# EAGLE design extruder-controller4 (EAGLE 5.04)
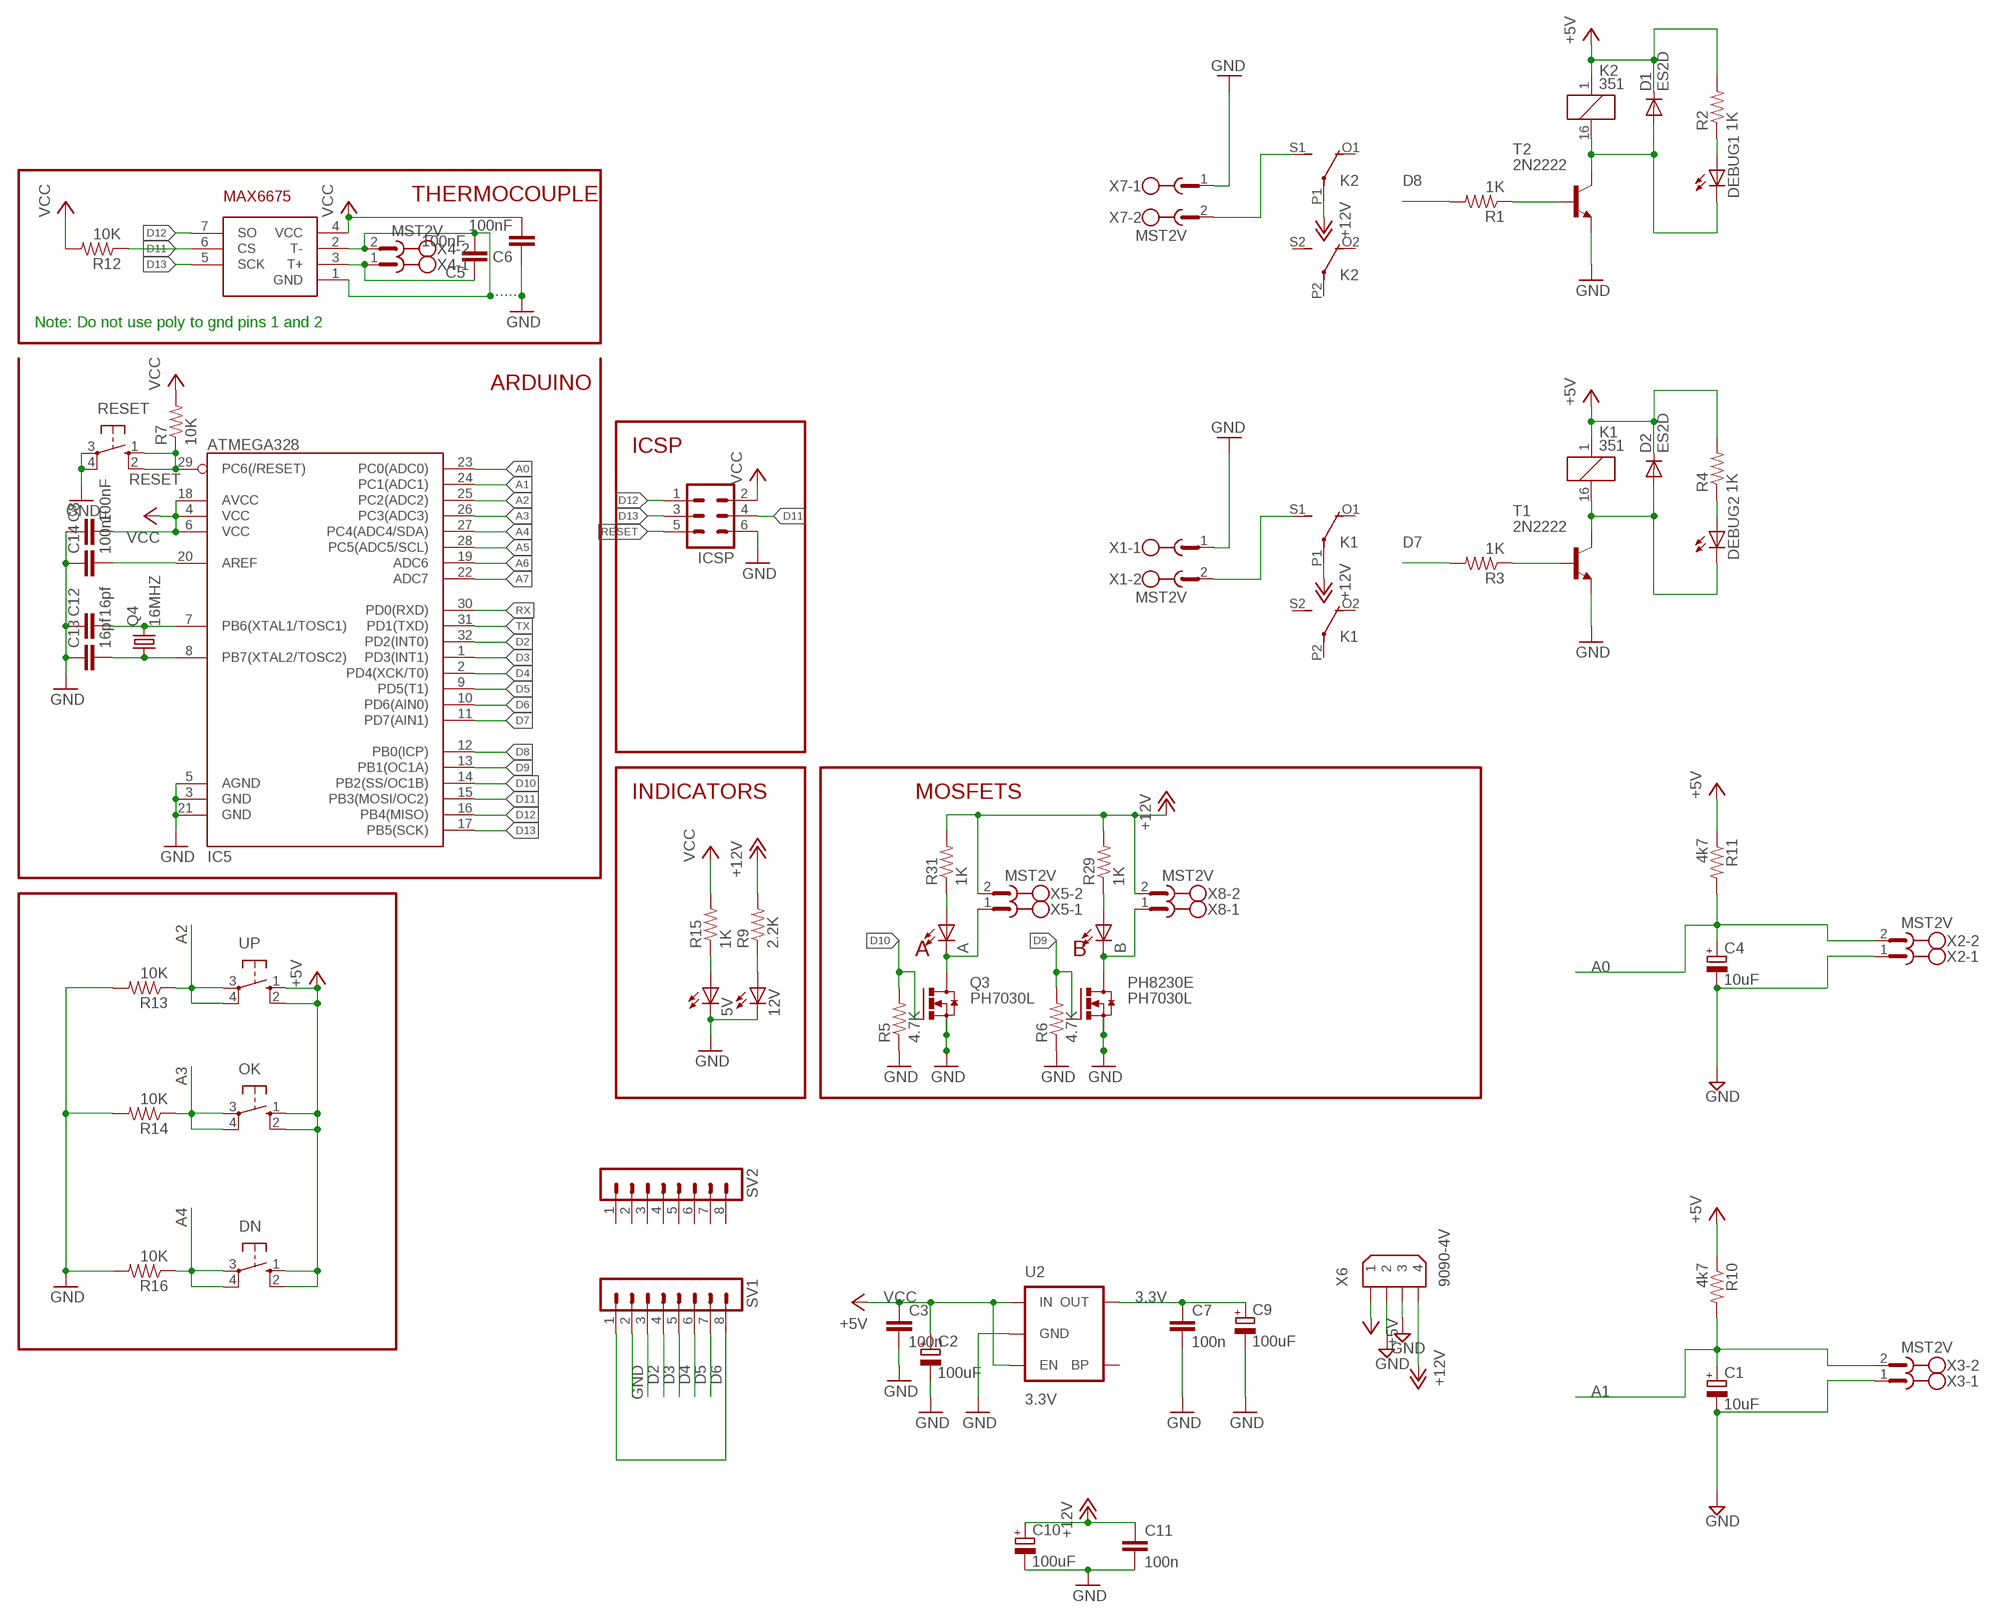
[diagram p0: schematic, sheet 1]

## Parts
5V  LED0805  [LED-0805]
12V  LED0805  [LED-0805]
A  LED0805  [LED-0805]
B  LED0805  [LED-0805]
C1  10uF  CPOL-EUE5-6  [E5-6]
C2  100uF  CPOL-EUE5-6  [E5-6]
C3  100n  CAP0805  [0805]
C4  10uF  CPOL-EUE5-6  [E5-6]
C5  100nF  CAP0805  [0805]
C6  100nF  CAP0805  [0805]
C7  100n  CAP0805  [0805]
C8  100nF  CAP0805  [0805]
C9  100uF  CPOL-EUE5-6  [E5-6]
C10  100uF  CPOL-EUE5-6  [E5-6]
C11  100n  CAP0805  [0805]
C12  16pf  CAP0805  [0805]
C13  16pf  CAP0805  [0805]
C14  100nF  CAP0805  [0805]
D1  ES2D  [SMB]
D2  ES2D  [SMB]
DEBUG1  LED0805  [LED-0805]
DEBUG2  LED0805  [LED-0805]
DN  10-XX  [B3F-10XX]
IC5  ATMEGA328  ATMEGA168  [TQFP32-08]
IC8  MAX6675  [SO08]
ICSP  ML6  [ML6]
K1  351  [351]
K2  351  [351]
OK  10-XX  [B3F-10XX]
PH8230E  PH7030L  [SOT669]
Q3  PH7030L  [SOT669]
Q4  16MHZ  CRYSTALHC49S  [HC49/S]
R1  1K  RESISTOR  [0805]
R2  1K  RESISTOR  [0805]
R3  1K  RESISTOR  [0805]
R4  1K  RESISTOR  [0805]
R5  4.7K  RESISTOR  [0805]
R6  4.7K  RESISTOR  [0805]
R7  10K  RESISTOR  [0805]
R9  2.2K  RESISTOR  [0805]
R10  4k7  RESISTOR  [0805]
R11  4k7  RESISTOR  [0805]
R12  10K  RESISTOR  [0805]
R13  10K  RESISTOR  [0805]
R14  10K  RESISTOR  [0805]
R15  1K  RESISTOR  [0805]
R16  10K  RESISTOR  [0805]
R29  1K  RESISTOR  [0805]
R31  1K  RESISTOR  [0805]
RESET  10-XX  [B3F-10XX]
SV1  MA08-1  [MA08-1]
SV2  MA08-1  [MA08-1]
T1  2N2222  MMBT2222ALT1-NPN-SOT23-BEC  [SOT23-BEC]
T2  2N2222  MMBT2222ALT1-NPN-SOT23-BEC  [SOT23-BEC]
U2  3.3V  V_REG_LDOSMD  [SOT23-5]
UP  10-XX  [B3F-10XX]
X1  MST2V  [MSTBV2]
X2  MST2V  [MSTBV2]
X3  MST2V  [MSTBV2]
X4  MST2V  [MSTBV2]
X5  MST2V  [MSTBV2]
X6  9090-4V  [9090-4V]
X7  MST2V  [MSTBV2]
X8  MST2V  [MSTBV2]

## Nets
3.3V: C7.1 C9.+ U2.5(OUT)
+12V [motors]: C10.+ C11.1 K1.P1(2:P) K2.P1(2:P) R9.2 R29.2 R31.2 X5.2 X6.4 X8.2
A0: C4.+ IC5.23(PC0(ADC0)) R11.2 X2.2
A1: C1.+ IC5.24(PC1(ADC1)) R10.2 X3.2
A2: IC5.25(PC2(ADC2)) R13.1 UP.3(P) UP.4(P1)
A3: IC5.26(PC3(ADC3)) OK.3(P) OK.4(P1) R14.1
A4: DN.3(P) DN.4(P1) IC5.27(PC4(ADC4/SDA)) R16.1
A5: IC5.28(PC5(ADC5/SCL))
A6: IC5.19(ADC6)
A7: IC5.22(ADC7)
APWR [motors]: A.C Q3.MB(D) X5.1
BPWR [motors]: B.C PH8230E.MB(D) X8.1
D2: IC5.32(PD2(INT0)) SV1.3
D3: IC5.1(PD3(INT1)) SV1.4
D4: IC5.2(PD4(XCK/T0)) SV1.5
D5: IC5.9(PD5(T1)) SV1.6
D6: IC5.10(PD6(AIN0)) SV1.7
D7: IC5.11(PD7(AIN1)) R3.2
D8: IC5.12(PB0(ICP)) R1.2
D9: IC5.13(PB1(OC1A)) PH8230E.4(G) R6.2
D10: IC5.14(PB2(SS/OC1B)) Q3.4(G) R5.2
D11: IC5.15(PB3(MOSI/OC2)) IC8.6(CS) ICSP.4 R12.1
D12: IC5.16(PB4(MISO)) IC8.7(SO) ICSP.1
D13: IC5.17(PB5(SCK)) IC8.5(SCK) ICSP.3
GND [vcc]: 5V.C 12V.C C1.- C2.- C3.2 C4.- C6.1 C7.2 C8.1 C9.- C10.- C11.2 C12.1 C13.1 C14.1 IC5.3(GND) IC5.5(AGND) IC5.21(GND) ICSP.6 PH8230E.1(S) PH8230E.2(S) PH8230E.3(S) Q3.1(S) Q3.2(S) Q3.3(S) R5.1 R6.1 R13.2 R14.2 R16.2 RESET.3(P) RESET.4(P1) SV1.2 T1.E T2.E U2.2(GND) X1.1 X2.1 X3.1 X6.2 X6.3 X7.1
N$1: C5.2 IC8.1(GND) IC8.2(T-) X4.2
N$2: R1.1 T2.B
N$3 [vcc]: K2.S1(2:S) X7.2
N$4: D1.A DEBUG1.C K2.16 T2.C
N$5 [vcc]: DEBUG1.A R2.1
N$6: R3.1 T1.B
N$7 [vcc]: K1.S1(2:S) X1.2
N$8: SV1.1 SV1.8
N$9: D2.A DEBUG2.C K1.16 T1.C
N$11: C5.1 IC8.3(T+) X4.1
N$12 [vcc]: DEBUG2.A R4.1
N$20: C14.2 IC5.20(AREF)
N$25: 5V.A R15.1
N$26: 12V.A R9.1
N$31: C12.2 IC5.7(PB6(XTAL1/TOSC1)) Q4.2
N$32: C13.2 IC5.8(PB7(XTAL2/TOSC2)) Q4.1
N$41: A.A R31.1
N$42: B.A R29.1
RESET: IC5.29(PC6(/RESET)) ICSP.5 R7.1 RESET.1(S) RESET.2(S1)
RX: IC5.30(PD0(RXD))
TX: IC5.31(PD1(TXD))
VCC: C2.+ C3.1 C6.2 C8.2 D1.C D2.C DN.1(S) DN.2(S1) IC5.4(VCC) IC5.6(VCC) IC5.18(AVCC) IC8.4(VCC) ICSP.2 K1.1 K2.1 OK.1(S) OK.2(S1) R2.2 R4.2 R7.2 R10.1 R11.1 R12.2 R15.2 U2.1(IN) U2.3(EN) UP.1(S) UP.2(S1) X6.1 ; supply symbol labelled +5V
Unconnected: K1.O1(2:O) K1.O2(3:O) K1.P2(3:P) K1.S2(3:S) K2.O1(2:O) K2.O2(3:O) K2.P2(3:P) K2.S2(3:S) SV2.1 SV2.2 SV2.3 SV2.4 SV2.5 SV2.6 SV2.7 SV2.8 U2.4(BP)

## Notes on the sheet
- THERMOCOUPLE
- .......
- Note: Do not use poly to gnd pins 1 and 2
- ARDUINO
- ICSP
- INDICATORS | MOSFETS
- A | B

## Library data of the parts
5V 12V A B DEBUG1 DEBUG2 = SparkFun:LED: LEDs Standard schematic elements and footprints for 5mm, 3mm, 1206, and 0603 sized LEDs. 5mm - Spark Fun Electronics SKU : COM-00529 (and others)
C1 C2 C4 C9 C10 = rcl:CPOL-EU: POLARIZED CAPACITOR, European symbol
C3 C5-C8 C11-C14 = SparkFun:CAP: Capacitor Standard 0603 ceramic capacitor, and 0.1" leaded capacitor.
D1 D2 = diode:ES2D: DIODE super fast rectifier, 2 A
DN OK RESET UP = switch-omron:10-XX: OMRON SWITCH
IC5 = SparkFun:ATMEGA168
IC8 = reprap:MAX6675: Thermocouple amplifier and A to D converter
ICSP = con-harting-ml:ML6: HARTING
K1 K2 = relay:351: RELAY 2 x switch, Omron
PH8230E Q3 = transistor-power:PH7030L: N-channel TrenchMOS (TM) logic level FET Source: http://www.nxp.com/acrobat_download/datasheets/PH7030L_4.pdf
Q4 = crystal:CRYSTAL: CRYSTAL
R1-R7 R9-R16 R29 R31 = SparkFun:RESISTOR: Resistor Basic schematic elements and footprints for 0603, 1206, and PTH 1/10th watt (small) resistors.
SV1 SV2 = con-lstb:MA08-1: PIN HEADER; OC_FARNELL: unknown; OC_NEWARK: unknown
T1 T2 = transistor:*-NPN-: NPN Transistror BF959 corrected 2008.03.06
U2 = SparkFun:V_REG_LDO: Voltage Regulator LDO Standard 150mA LDO voltage regulator in SOT-23 layout. Micrel part MIC5205. BP (by-pass) pin is used to lower output noise with 470pF cap.
X1-X5 X7 X8 = con-phoenix-508:MST2V: PHOENIX
X6 = con-thomas-betts:9090-4: Disk Drive Power four position Source: Thomas & Betts Electronic Interconnects Eiropean Edition 1998

## Net classes
0 default: width 0.305 mm
1 vcc: width 0.305 mm
2 motors: width 1.016 mm

## Board
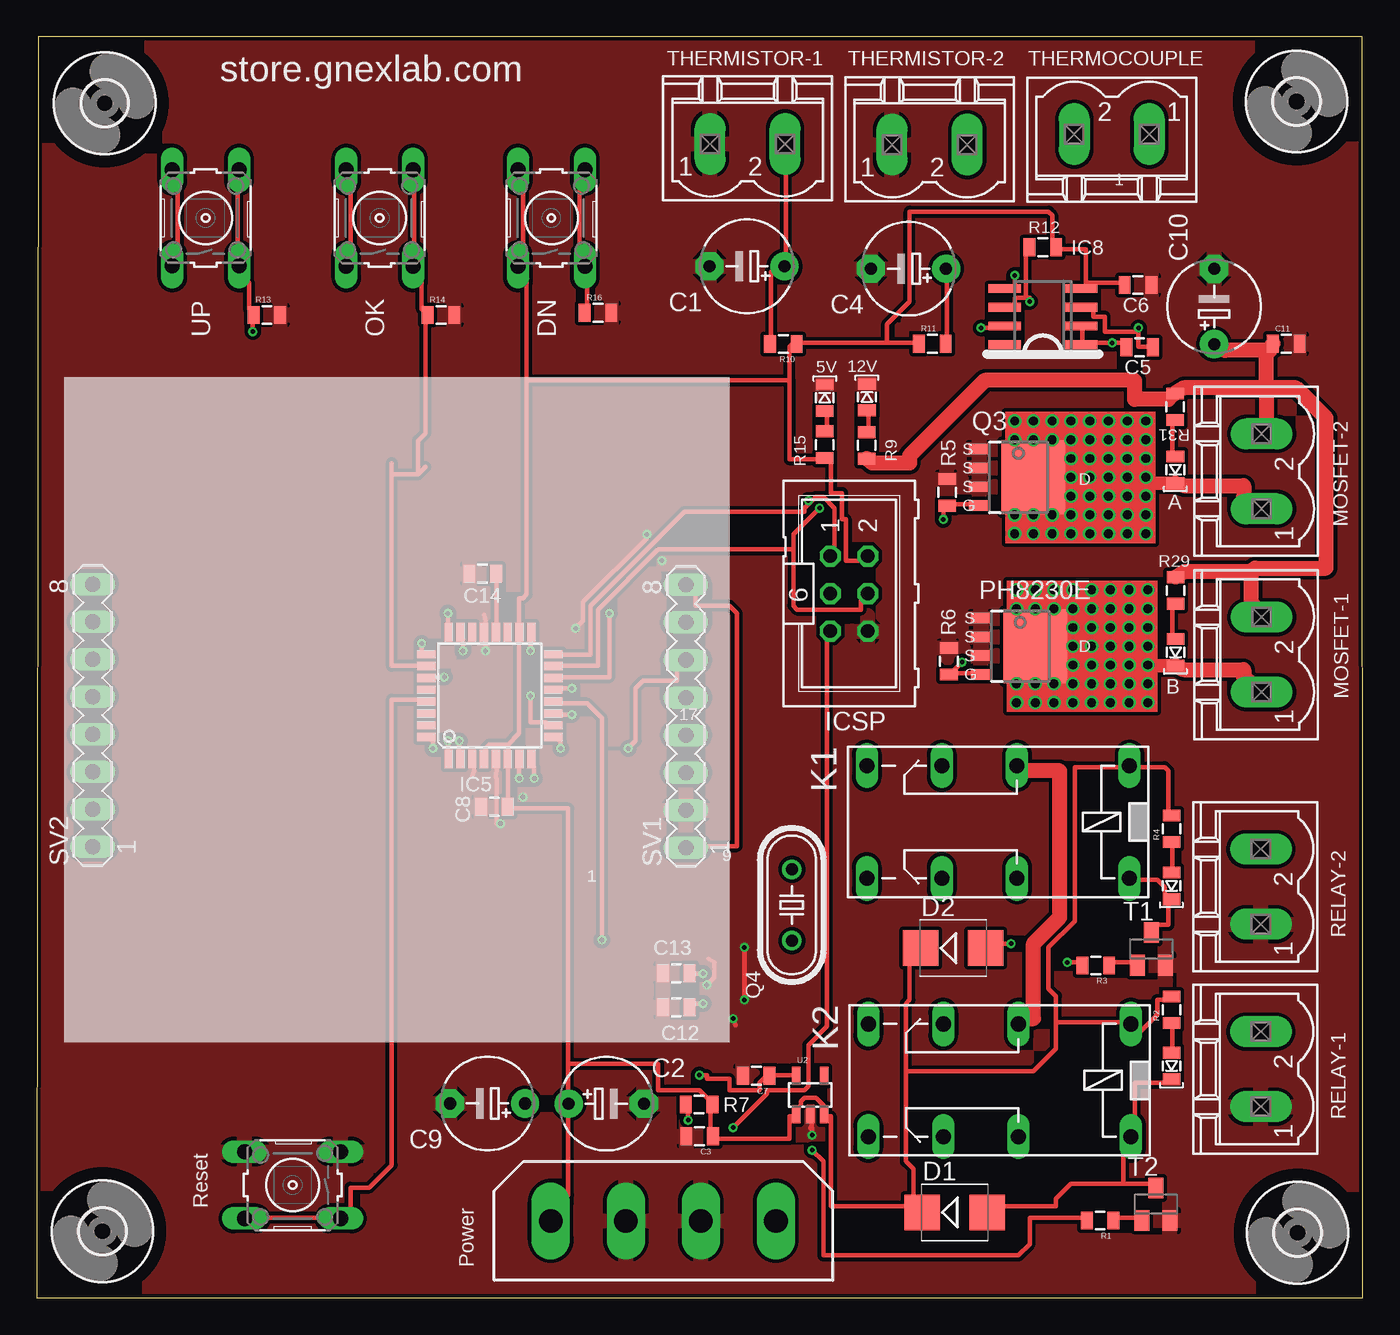
[diagram p1: board, top side]
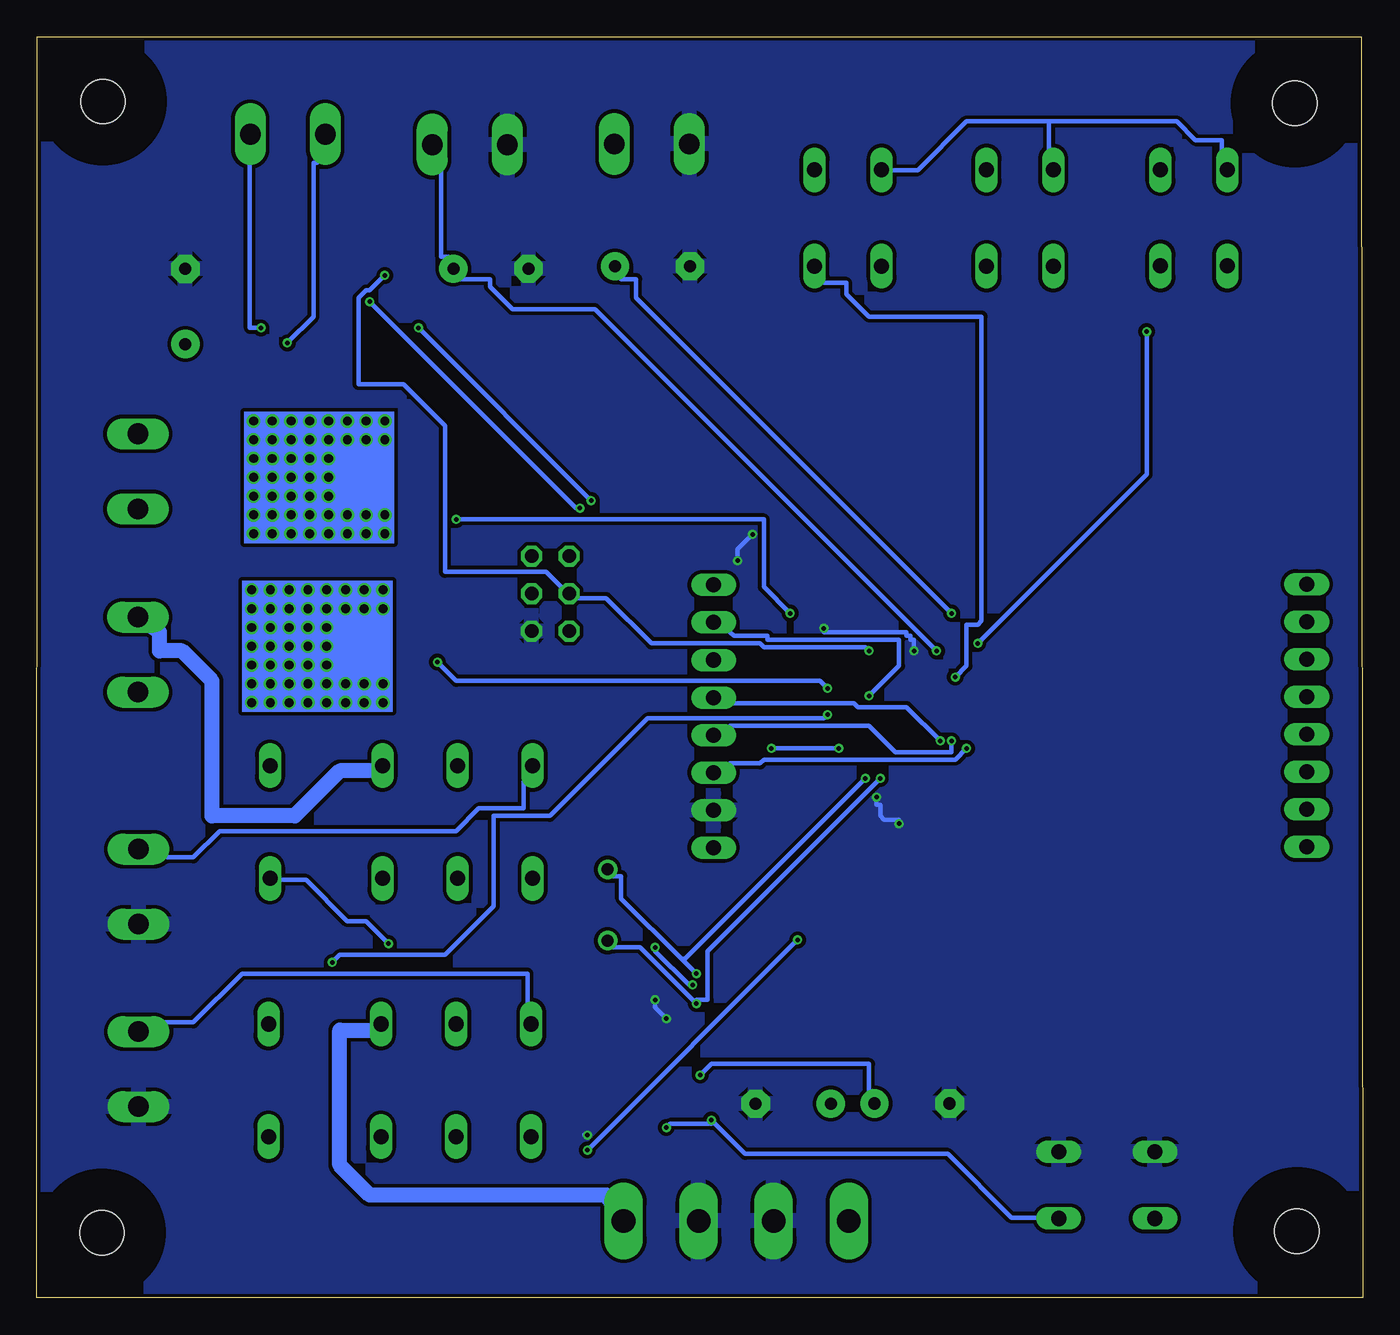
[diagram p2: board, bottom side, seen from below]

Size 89.71 x 85.29 mm. Coordinates in mm from the lower left corner, seen from the top.
Outline: 0,0 89.71,0 89.68,85.29 0.09,85.29 0,0
Copper layers (1*16): Top 0.035mm / dielectric 1.5mm / Bottom 0.035mm
Design rules "ITead_rule": minimum track width 6mil, minimum drill 12mil, track to track 6mil, track to pad 6mil, pad to pad 6mil, via to via 6mil, smd to smd 0mil, copper to edge 10mil, drill to drill 10mil, minimum pad ring 10mil, minimum via ring 6mil, stop-mask expansion 2mil, vias tented up to drill 100mil, thermal gap 10mil

### Footprints (pad centres in the part's own frame; a part is rotated, then mirrored left to right if it is on the bottom)
LED-0805 = smd 1.2 x 0.8: A 0,-0.9; C 0,0.9
E5-6 = drill 0.813 pad 1.905 round: + -2.54,0 | drill 0.813 pad 1.905 octagon: - 2.54,0
0805 = smd 0.8 x 1.2: 1 -0.9,0; 2 0.9,0
SMB = smd 2.4 x 2.4: A 2.2,0; C -2.2,0
B3F-10XX = drill 1.016 long: 1 -3.251,2.261; 2 3.251,2.261; 3 -3.251,-2.261; 4 3.251,-2.261
TQFP32-08 = smd 1.27 x 0.559: 1 -4.293,2.8; 2 -4.293,2; 3 -4.293,1.2; 4 -4.293,0.4; 5 -4.293,-0.4; 6 -4.293,-1.2; 7 -4.293,-2; 8 -4.293,-2.8; 17 4.293,-2.8; 18 4.293,-2; 19 4.293,-1.2; 20 4.293,-0.4; 21 4.293,0.4; 22 4.293,1.2; 23 4.293,2; 24 4.293,2.8 | smd 0.559 x 1.27: 9 -2.8,-4.293; 10 -2,-4.293; 11 -1.2,-4.293; 12 -0.4,-4.293; 13 0.4,-4.293; 14 1.2,-4.293; 15 2,-4.293; 16 2.8,-4.293; 25 2.8,4.293; 26 2,4.293; 27 1.2,4.293; 28 0.4,4.293; 29 -0.4,4.293; 30 -1.2,4.293; 31 -2,4.293; 32 -2.8,4.293
SO08 = smd 0.6 x 2.2: 1 -1.905,-2.6; 2 -0.635,-2.6; 3 0.635,-2.6; 4 1.905,-2.6; 5 1.905,2.6; 6 0.635,2.6; 7 -0.635,2.6; 8 -1.905,2.6
ML6 = drill 0.914 octagon: 1 -2.54,-1.27; 2 -2.54,1.27; 3 0,-1.27; 4 0,1.27; 5 2.54,-1.27; 6 2.54,1.27
351 = drill 1.016 long: 1 -3.81,-3.81; 16 -3.81,3.81; O1 8.89,-3.81; O2 8.89,3.81; P1 3.81,-3.81; P2 3.81,3.81; S1 13.97,-3.81; S2 13.97,3.81
SOT669 = smd 0.7 x 1.4: 1 -1.905,-2.65; 2 -0.635,-2.65; 3 0.635,-2.65; 4 1.905,-2.65 | smd 5 x 4.3: MB 0,1
HC49/S = drill 0.813 round: 1 -2.413,0; 2 2.413,0
MA08-1 = drill 1.016 long: 1 -8.89,0; 2 -6.35,0; 3 -3.81,0; 4 -1.27,0; 5 1.27,0; 6 3.81,0; 7 6.35,0; 8 8.89,0
SOT23-BEC = smd 1 x 1.4: B -0.95,-1.1; C 0,1.1; E 0.95,-1.1
SOT23-5 = smd 0.55 x 1.2: 1 -0.95,-1.3; 2 0,-1.3; 3 0.95,-1.3; 4 0.95,1.3; 5 -0.95,1.3
3,0 = hole 3: 0,0
MSTBV2 = drill 1.397 long: 1 -2.54,0; 2 2.54,0
9090-4V = drill 1.6 pad 2.6 long: 1 -7.62,0; 2 -2.54,0; 3 2.54,0; 4 7.62,0

### Placement (x,y rotation side)
5V  53.32,60.88 0 top
12V  56.17,60.93 0 top
A  77.04,56.01 180 top
B  77.06,43.66 180 top
C1  48.05,69.77 180 top
C2  38.53,13.13 0 top
C3  44.85,10.92 180 top
C4  58.99,69.62 180 top
C5  74.63,64.31 180 top
C6  74.52,68.51 180 top
C7  48.69,15.01 180 top
C8  30.95,33.21 0 top
C9  30.49,13.14 180 top
C10  79.67,67.06 90 top
C11  84.55,64.54 0 top
C12  43.27,19.65 0 top
C13  43.27,21.95 0 top
C14  30.16,48.98 0 top
D1  62.11,5.77 0 top
D2  62.01,23.65 0 top
DEBUG1  76.79,15.67 180 top
DEBUG2  76.79,27.86 180 top
DN  34.82,73.05 90 top
IC5  30.65,40.73 90 top
IC8  68.08,66.37 90 top
ICSP  54.96,47.64 270 top
K1  70.13,32.18 180 top
K2  70.24,14.71 180 top
OK  23.19,73.04 90 top
PH8230E  66.55,44.07 270 top
Q3  66.42,55.5 270 top
Q4  51.08,26.57 270 top
R1  71.96,5.22 180 top
R2  76.79,19.48 90 top
R3  71.66,22.48 180 top
R4  76.79,31.72 90 top
R5  61.6,54.49 270 top
R6  61.72,43.06 270 top
R7  44.81,13.08 0 top
R9  56.16,57.66 270 top
R10  50.51,64.53 180 top
R11  60.59,64.54 0 top
R12  68.08,71.07 0 top
R13  15.57,66.49 0 top
R14  27.34,66.49 0 top
R15  53.32,57.71 270 top
R16  37.97,66.64 0 top
R29  77.06,47.85 90 top
R31  77.02,60.28 90 top
RESET  17.31,7.62 180 top
SV1  43.92,39.33 90 top
SV2  3.78,39.39 90 top
T1  75.42,23.6 0 top
T2  75.72,6.32 0 top
U2  52.33,13.71 0 top
U$1  [3,0]  4.44,4.49 0 top
U$2  [3,0]  4.59,80.81 0 top
U$3  [3,0]  85.25,80.93 0 top
U$4  [3,0]  85.32,4.39 0 top
UP  11.42,73.05 90 top
X1  82.83,27.81 90 top
X2  60.42,78 0 top
X3  48.1,78.06 0 top
X4  72.74,78.71 180 top
X5  82.88,55.91 90 top
X6  42.4,5.2 0 top
X7  82.83,15.47 90 top
X8  82.88,43.51 90 top

### Tracks (layer width: path | path; a pad name or v marks a point on that pad's centre or on a via)
3.3V  (via drill 0.3)
  Top 0.305: U2.5 51.19,15.06 49.92,15.06 C7.1 49.41,15.06 48.9,14.55 48.9,14.05 46.87,14.05 46.87,14.81 45.34,14.81 45.34,15.06 v44.84,15.06
  Bottom 0.305: v44.84,15.06 44.07,15.82 33.41,15.82 33.41,14.05 C9.+
+12V
  Top 1.016: R9.2 56.52,56.46 59.06,56.46 59.06,56.97 64.14,62.05 74.3,62.05 74.3,60.78 76.59,60.78 R31.2 77.6,61.54 83.19,61.54 | 82.17,49.1 77.6,49.1 R29.2 | 82.17,49.1 82.17,47.07 X8.2 | 83.19,64.08 83.44,64.08 C11.1 | 83.19,61.54 83.19,59.26 X5.2 | 83.19,61.54 83.19,64.08 | C10.+ 80.4,64.08 83.19,64.08 | 82.17,49.1 82.43,49.35 87.25,49.35 87.25,59.51 85.22,61.54 83.19,61.54 | K1.P1 66.93,35.64 69.22,35.64 69.22,25.73 67.44,23.95 67.44,18.87 66.93,18.87 K2.P1
  Bottom 1.016: X6.4 51.19,6.93 67.19,6.93 69.22,8.97 69.22,18.11 66.93,18.11 K2.P1 | X8.2 81.41,45.03 81.41,43.76 79.89,43.76 77.86,41.73 77.86,32.59 72.27,32.59 69.22,35.64 66.93,35.64 K1.P1
A0  (via drill 0.3)
  Top 0.305: R11.2 61.6,65.1 61.6,68.91 C4.+ | v28.83,43.76 28.83,44.53 IC5.23
  Bottom 0.305: v28.83,43.76 51.95,66.88 57.54,66.88 59.06,68.4 59.06,68.91 61.09,68.91 C4.+ 61.85,70.43 62.36,70.43 62.36,76.28 X2.2
A1  (via drill 0.3)
  Top 0.305: R10.2 49.66,65.1 49.66,69.42 C1.+ 50.68,70.69 50.68,76.02 X3.2 | v27.82,46.3 27.82,45.54 IC5.24
  Bottom 0.305: v27.82,46.3 49.15,67.64 49.15,68.91 50.17,68.91 C1.+
A2  (via drill 0.3)
  Top 0.305: v26.04,44.27 26.04,43.76 IC5.25 | v14.61,65.35 14.61,66.12 R13.1 14.36,66.88 14.36,68.66 UP.3 13.59,71.2 13.59,75.01 UP.4
  Bottom 0.305: v26.04,44.27 14.61,55.7 v14.61,65.35
A3
  Top 0.305: 24.01,55.7 24.01,42.75 25.79,42.75 IC5.26 | 24.01,55.7 24.01,56.46 | R14.1 26.45,66.08 | 25.79,55.7 26.29,56.21 | 24.01,55.7 25.79,55.7 | R14.1 26.29,66.88 26.04,66.88 26.04,68.66 OK.3 25.53,71.2 25.53,75.01 OK.4 | 25.79,55.7 25.79,57.99 26.29,58.5 26.29,66.12 R14.1
A4  (via drill 0.3)
  Top 0.305: R16.1 37.22,67.13 37.22,68.4 DN.3 36.71,71.2 36.71,75.01 DN.4 | v27.56,41.99 26.8,41.99 IC5.27
  Bottom 0.305: v27.56,41.99 26.8,42.75 26.8,45.54 26.04,45.54 25.79,45.8 25.79,66.37 33.41,66.37 34.93,67.89 34.93,68.66 36.45,68.66 DN.3
APWR
  Top 0.914: A.C 67.42,55.11 Q3.MB
  Top 1.016: A.C 77.6,54.94 81.67,54.94 81.67,54.18 X5.1
BPWR
  Top 0.914: B.C 67.55,42.76 PH8230E.MB
  Top 1.016: B.C 77.6,42.49 81.67,42.49 81.67,41.99 X8.1
D2  (via drill 0.3)
  Top 0.305: v26.8,37.16 26.8,37.67 IC5.32
  Bottom 0.305: v26.8,37.16 27.56,36.4 40.52,36.4 40.77,36.14 42.8,36.14 SV1.3
D3  (via drill 0.3)
  Top 0.305: v27.82,37.67 27.82,36.91 IC5.1
  Bottom 0.305: v27.82,37.67 27.82,36.91 31.63,36.91 33.41,38.68 42.8,38.68 SV1.4
D4  (via drill 0.3)
  Top 0.305: v28.58,37.67 28.58,36.91 IC5.2
  Bottom 0.305: v28.58,37.67 30.87,39.95 34.17,39.95 34.42,40.21 42.55,40.21 SV1.5
D5  (via drill 0.3)
  Top 0.305: v35.44,37.16 35.44,37.67 IC5.9 | v40.01,37.16 40.52,37.67 40.52,41.22 41.03,41.73 43.31,41.73 43.31,42.49 SV1.6
  Bottom 0.305: v35.44,37.16 v40.01,37.16
D6  (via drill 0.3)
  Top 0.305: v33.41,40.72 33.41,38.94 34.42,38.94 IC5.10
  Bottom 0.305: v33.41,40.72 31.37,42.75 31.37,44.53 40.26,44.53 40.26,44.78 42.55,44.78 42.8,45.03 SV1.7
D7  (via drill 0.3)
  Top 0.305: v69.73,22.68 70.49,22.68 R3.2 | v36.2,39.45 35.44,39.45 IC5.11
  Bottom 0.305: v69.73,22.68 69.22,23.19 62.11,23.19 58.81,26.49 58.81,32.59 55,32.59 48.39,39.19 36.45,39.19 v36.2,39.45
D8  (via drill 0.3)
  Top 0.305: v52.46,9.98 53.22,9.22 53.22,2.87 66.43,2.87 67.19,3.63 67.19,5.41 70.74,5.41 R1.2 | v38.23,24.21 38.23,39.19 37.22,40.21 35.44,40.21 IC5.12
  Bottom 0.305: v52.46,9.98 v38.23,24.21
D9  (via drill 0.3)
  Top 0.305: PH8230E.4 63.38,42.24 62.11,42.24 R6.2 62.11,42.49 v62.62,43 | v36.2,41.22 35.44,41.22 IC5.13
  Bottom 0.305: v36.2,41.22 36.71,41.73 61.35,41.73 v62.62,43
D10  (via drill 0.3)
  Top 0.305: Q3.4 63.12,53.67 62.11,53.67 R5.2 61.35,53.42 v61.35,52.65 | v38.74,46.3 38.74,41.99 35.44,41.99 IC5.14
  Bottom 0.305: v38.74,46.3 40.52,48.08 40.52,52.65 v61.35,52.65
D11  (via drill 0.3)
  Top 0.305: 66.93,67.64 66.93,70.69 R12.1 | 66.93,67.64 66.17,67.64 66.17,67.13 IC8.6 | 51.19,50.62 42.04,50.62 37.98,46.56 37.98,42.75 35.44,42.75 IC5.15 | 51.19,50.62 51.19,46.81 51.44,46.56 55.76,46.56 55.76,47.32 ICSP.4 | 66.93,67.64 67.19,67.64 v67.19,67.39 | v52.96,53.42 51.19,51.64 51.19,50.62
  Bottom 0.305: v67.19,67.39 53.22,53.42 v52.96,53.42
D12  (via drill 0.3)
  Top 0.305: 52.46,53.92 52.71,54.18 53.22,54.18 53.98,53.42 53.98,50.88 ICSP.1 | 52.46,53.92 51.95,53.42 51.95,53.16 43.82,53.16 37.47,46.81 37.47,43.51 35.44,43.51 IC5.16 | v63.89,65.61 64.39,65.61 IC8.7 | 52.46,53.92 v52.2,53.92
  Bottom 0.305: v52.2,53.92 v63.89,65.61
D13  (via drill 0.3)
  Top 0.305: v33.41,43.76 33.41,44.53 IC5.17 | v66.17,69.16 66.17,68.4 IC8.5
  Bottom 0.305: v33.41,43.76 33.66,44.02 40.52,44.02 40.77,44.27 48.14,44.27 51.19,47.32 53.22,47.32 ICSP.3 54.23,48.08 55.25,49.1 62.11,49.1 62.11,59 64.9,61.8 67.95,61.8 67.95,67.64 67.44,68.15 67.19,68.15 v66.17,69.16
GND  (via drill 0.3)
  Top 0.305: U2.2 52.46,12.01 52.46,11.76 52.37,11.54 | 52.37,11.54 52.33,11.45 | IC5.3 29.6,35.89 29.6,35.64 29.45,35.25 | IC5.5 31.12,35.89 31.12,35.64 31.05,35.25 31.12,35.13 31.12,32.08 v31.37,32.08 | 30.25,46.22 30.36,45.8 30.36,45.54 IC5.21 30.36,44.53 v30.36,43.76 | v36.45,45.29 36.96,45.8 36.96,47.07 41.28,51.38 v41.28,51.64 | v42.3,49.86 42.42,49.71 | v32.9,33.86 32.99,34.01 | v45.34,21.16 45.85,21.67 45.85,22.68 45.45,22.93 | v47.88,20.14 v47.88,23.7 | v47.12,18.87 47.27,18.44 | v52.46,11 52.46,11.51 52.37,11.54
  Bottom 0.305: v30.36,43.76 30.36,44.53 30.61,44.53 30.61,44.78 30.87,44.78 30.87,45.03 36.45,45.03 v36.45,45.29 | v41.28,51.64 42.3,50.62 v42.3,49.86 | v31.37,32.08 31.37,32.33 32.39,32.33 32.64,32.59 32.64,33.35 32.9,33.35 v32.9,33.86 | v45.34,21.16 45.6,21.16 47.88,23.44 v47.88,23.7 | v47.88,20.14 47.88,19.63 v47.12,18.87 | v52.46,11 52.69,11.04
  pour Top (isolate 0.254): -14.18,87.68 122.53,86.68 122.39,-3.48 -13.45,-2.49
  pour Bottom (isolate 0.254): -5.72,87.68 111.85,87.16 113.78,-3.82 -5.14,-3.31
N$1  (via drill 0.3)
  Top 0.305: C5.2 73.54,64.59 v72.78,64.59 71.76,64.59 IC8.1 70.74,64.59 70.74,65.61 IC8.2
  Bottom 0.305: v72.78,64.59 71,66.37 71,76.78 70.74,76.78 X4.2
N$2
  Top 0.305: R1.1 73.03,5.41 74.3,5.41 T2.B
N$3
  Bottom 0.305: K2.S1 56.52,19.89 56.52,21.92 75.82,21.92 79.13,18.62 81.16,18.62 X7.2
N$4
  Top 0.305: DEBUG1.C 76.33,14.55 74.3,14.55 74.3,12.27 K2.16 73.54,9.73 73.54,7.7 | 73.54,7.7 75.32,7.7 T2.C | 73.54,7.7 69.98,7.7 68.97,6.68 68.97,6.17 65.41,6.17 D1.A
N$5
  Top 0.305: DEBUG1.A 76.84,16.84 76.84,18.36 R2.1
N$6
  Top 0.305: R3.1 72.78,22.68 74.05,22.68 T1.B
N$7
  Bottom 0.305: K1.S1 56.77,34.87 56.77,33.1 59.82,33.1 61.35,31.57 77.35,31.57 79.13,29.79 80.9,29.79 X1.2
N$8
  Top 0.305: SV1.1 45.34,30.56 47.38,30.56 47.38,46.3 46.87,46.81 44.58,46.81 44.58,47.57 SV1.8
N$9  (via drill 0.3)
  Top 0.305: K1.16 74.55,28.27 75.82,28.27 76.33,27.76 76.33,27.25 DEBUG2.C 76.59,26.75 76.59,25.22 75.82,25.22 T1.C | v65.92,23.95 65.16,23.95 D2.A
  Bottom 0.305: v65.92,23.95 67.44,25.48 68.71,25.48 71.51,28.27 73.28,28.27 K1.16
N$10  (via drill 0.6 pad 0)
  other vias: 66.17,59.31
N$11  (via drill 0.3)
  Top 0.305: 74.55,65.35 74.55,64.34 75.32,64.34 C5.1 | 74.55,65.35 72.27,65.35 72.27,66.37 71.51,66.37 71.51,66.88 IC8.3 | 74.55,65.35 v74.55,65.61
  Bottom 0.305: v74.55,65.61 75.32,65.61 75.32,76.78 X4.1
N$12
  Top 0.305: DEBUG2.A 76.84,29.03 76.84,30.56 R4.1
N$13  (via drill 0.6 pad 0)
  other vias: 67.44,59.31
N$14  (via drill 0.6 pad 0)
  other vias: 68.71,59.31
N$15  (via drill 0.6 pad 0)
  other vias: 69.98,59.31
N$16  (via drill 0.6 pad 0)
  other vias: 71.25,59.31
N$17  (via drill 0.6 pad 0)
  other vias: 72.52,59.31
N$19  (via drill 0.6 pad 0)
  other vias: 73.79,59.31
N$20
  Top 0.305: C14.2 31.12,48.59 31.12,45.54 IC5.20
N$21  (via drill 0.6 pad 0)
  other vias: 75.06,59.31
N$22  (via drill 0.6 pad 0)
  other vias: 75.06,58.04
N$24  (via drill 0.6 pad 0)
  other vias: 73.79,58.04
N$25
  Top 0.305: R15.1 53.47,59 53.47,59.77 5V.A
N$26
  Top 0.305: R9.1 56.27,58.75 56.27,59.77 12V.A
N$27  (via drill 0.6 pad 0)
  other vias: 72.52,58.04
N$28  (via drill 0.6 pad 0)
  other vias: 71.25,58.04
N$31  (via drill 0.3)
  Top 0.305: v45.09,19.89 44.33,19.89 C12.2 | v32.64,35.13 32.64,35.89 IC5.7
  Bottom 0.305: Q4.2 50.68,23.7 48.9,23.7 v45.09,19.89 45.09,20.14 44.33,20.14 44.33,23.44 v32.64,35.13
N$32  (via drill 0.3)
  Top 0.305: v45.09,21.92 44.33,21.92 C13.2 | v33.66,35.13 33.66,35.89 IC5.8
  Bottom 0.305: 46.11,22.94 50.17,27 50.17,28.52 50.68,28.52 Q4.1 | v45.09,21.92 46.11,22.94 | v33.66,35.13 45.85,22.94 46.11,22.94
N$33  (via drill 0.6 pad 0)
  other vias: 69.98,58.04
N$34  (via drill 0.6 pad 0)
  other vias: 68.71,58.04
N$35  (via drill 0.6 pad 0)
  other vias: 67.44,58.04
N$41
  Top 0.305: R31.1 76.84,59 76.84,57.23 A.A
N$42
  Top 0.305: B.A 76.84,44.78 76.84,46.56 R29.1
N$43  (via drill 0.6 pad 0)
  other vias: 66.17,58.04
N$54  (via drill 0.6 pad 0)
  other vias: 69.98,56.77
N$55  (via drill 0.6 pad 0)
  other vias: 71.25,56.77
N$56  (via drill 0.6 pad 0)
  other vias: 72.52,56.77
N$57  (via drill 0.6 pad 0)
  other vias: 73.79,56.77
N$58  (via drill 0.6 pad 0)
  other vias: 75.06,56.77
N$62  (via drill 0.6 pad 0)
  other vias: 69.98,55.5
N$63  (via drill 0.6 pad 0)
  other vias: 71.25,55.5
N$64  (via drill 0.6 pad 0)
  other vias: 72.52,55.5
N$65  (via drill 0.6 pad 0)
  other vias: 73.79,55.5
N$66  (via drill 0.6 pad 0)
  other vias: 75.06,55.5
N$70  (via drill 0.6 pad 0)
  other vias: 69.98,54.23
N$71  (via drill 0.6 pad 0)
  other vias: 71.25,54.23
N$72  (via drill 0.6 pad 0)
  other vias: 72.52,54.23
N$73  (via drill 0.6 pad 0)
  other vias: 73.79,54.23
N$74  (via drill 0.6 pad 0)
  other vias: 75.06,54.23
N$75  (via drill 0.6 pad 0)
  other vias: 75.06,52.96
N$76  (via drill 0.6 pad 0)
  other vias: 73.79,52.96
N$77  (via drill 0.6 pad 0)
  other vias: 72.52,52.96
N$78  (via drill 0.6 pad 0)
  other vias: 71.25,52.96
N$79  (via drill 0.6 pad 0)
  other vias: 69.98,52.96
N$80  (via drill 0.6 pad 0)
  other vias: 68.71,52.96
N$81  (via drill 0.6 pad 0)
  other vias: 67.44,52.96
N$82  (via drill 0.6 pad 0)
  other vias: 66.17,52.96
N$84  (via drill 0.6 pad 0)
  Top 0.61: v66.17,51.69 v67.44,51.69
N$85  (via drill 0.6 pad 0)
  other vias: 68.71,51.69
N$86  (via drill 0.6 pad 0)
  other vias: 69.98,51.69
N$87  (via drill 0.6 pad 0)
  other vias: 71.25,51.69
N$88  (via drill 0.6 pad 0)
  other vias: 72.52,51.69
N$89  (via drill 0.6 pad 0)
  other vias: 73.79,51.69
N$90  (via drill 0.6 pad 0)
  other vias: 75.06,51.69
N$91  (via drill 0.6 pad 0)
  other vias: 66.3,47.88
N$92  (via drill 0.6 pad 0)
  other vias: 67.57,47.88
N$93  (via drill 0.6 pad 0)
  other vias: 68.84,47.88
N$94  (via drill 0.6 pad 0)
  other vias: 70.11,47.88
N$95  (via drill 0.6 pad 0)
  other vias: 71.38,47.88
N$96  (via drill 0.6 pad 0)
  other vias: 72.65,47.88
N$97  (via drill 0.6 pad 0)
  other vias: 73.92,47.88
N$98  (via drill 0.6 pad 0)
  other vias: 75.19,47.88
N$99  (via drill 0.6 pad 0)
  other vias: 75.19,46.61
N$100  (via drill 0.6 pad 0)
  other vias: 73.92,46.61
N$101  (via drill 0.6 pad 0)
  other vias: 72.65,46.61
N$102  (via drill 0.6 pad 0)
  other vias: 71.38,46.61
N$103  (via drill 0.6 pad 0)
  other vias: 70.11,46.61
N$104  (via drill 0.6 pad 0)
  other vias: 68.84,46.61
N$105  (via drill 0.6 pad 0)
  other vias: 67.57,46.61
N$106  (via drill 0.6 pad 0)
  other vias: 66.3,46.61
N$110  (via drill 0.6 pad 0)
  other vias: 70.11,45.34
N$111  (via drill 0.6 pad 0)
  other vias: 71.38,45.34
N$112  (via drill 0.6 pad 0)
  other vias: 72.65,45.34
N$113  (via drill 0.6 pad 0)
  other vias: 73.92,45.34
N$114  (via drill 0.6 pad 0)
  other vias: 75.19,45.34
N$115  (via drill 0.6 pad 0)
  other vias: 75.19,44.07
N$116  (via drill 0.6 pad 0)
  other vias: 73.92,44.07
N$117  (via drill 0.6 pad 0)
  other vias: 72.65,44.07
N$118  (via drill 0.6 pad 0)
  other vias: 71.38,44.07
N$119  (via drill 0.6 pad 0)
  other vias: 70.11,44.07
N$126  (via drill 0.6 pad 0)
  other vias: 70.11,42.8
N$127  (via drill 0.6 pad 0)
  other vias: 71.38,42.8
N$128  (via drill 0.6 pad 0)
  other vias: 72.65,42.8
N$129  (via drill 0.6 pad 0)
  other vias: 73.92,42.8
N$130  (via drill 0.6 pad 0)
  other vias: 75.19,42.8
N$131  (via drill 0.6 pad 0)
  other vias: 66.3,41.53
N$132  (via drill 0.6 pad 0)
  other vias: 67.57,41.53
N$133  (via drill 0.6 pad 0)
  other vias: 68.84,41.53
N$134  (via drill 0.6 pad 0)
  other vias: 70.11,41.53
N$135  (via drill 0.6 pad 0)
  other vias: 71.38,41.53
N$136  (via drill 0.6 pad 0)
  other vias: 72.65,41.53
N$137  (via drill 0.6 pad 0)
  other vias: 73.92,41.53
N$138  (via drill 0.6 pad 0)
  other vias: 75.19,41.53
N$139  (via drill 0.6 pad 0)
  other vias: 75.19,40.26
N$140  (via drill 0.6 pad 0)
  other vias: 73.92,40.26
N$141  (via drill 0.6 pad 0)
  other vias: 72.65,40.26
N$142  (via drill 0.6 pad 0)
  other vias: 71.38,40.26
N$143  (via drill 0.6 pad 0)
  other vias: 70.11,40.26
N$144  (via drill 0.6 pad 0)
  other vias: 68.84,40.26
N$145  (via drill 0.6 pad 0)
  other vias: 67.57,40.26
N$146  (via drill 0.6 pad 0)
  other vias: 66.3,40.26
RESET  (via drill 0.3)
  Top 0.305: v44.07,12.01 44.07,12.52 R7.1 | IC5.29 25.79,40.46 24.01,40.46 24.01,8.97 22.48,7.44 21.21,7.44 21.21,5.92 RESET.1 19.18,5.41 15.37,5.41 RESET.2 | v47.12,11.51 49.41,13.79 49.41,14.05 51.95,14.05 52.2,14.3 52.2,17.09 53.47,18.36 53.47,44.53 ICSP.5
  Bottom 0.305: RESET.1 21.98,5.41 23.75,5.41 28.07,9.73 41.79,9.73 v44.07,12.01 44.07,11.76 46.87,11.76 v47.12,11.51
VCC
  Top 0.305: R4.2 76.59,32.84 76.59,35.64 76.33,35.89 74.55,35.89 K1.1 73.28,35.89 70.24,35.89 70.24,25.48 68.46,23.7 68.46,20.9 68.97,20.4 68.97,18.62 | R2.2 76.33,20.14 75.82,20.14 75.82,19.13 74.55,17.86 K2.1 73.54,18.62 68.97,18.62 | 58.81,15.32 58.81,9.22 59.31,8.71 59.31,6.93 D1.C 58.81,6.17 53.73,6.17 53.73,12.27 53.47,12.27 U2.3 53.22,12.78 53.22,13.03 52.71,13.54 51.95,13.54 51.69,13.28 51.69,13.03 51.44,12.78 U2.1 51.19,12.27 50.93,12.27 50.93,10.74 46.11,10.74 C3.1 45.6,11.51 45.6,12.52 R7.2 45.34,13.54 44.84,14.05 42.04,14.05 42.04,15.82 35.95,15.82 | 58.81,15.32 58.81,19.89 59.06,20.14 59.06,22.68 D2.C | 68.97,18.62 68.97,16.84 67.44,15.32 58.81,15.32 | 71,68.66 71,68.4 IC8.4 | 71,68.66 71,70.94 69.22,70.94 R12.2 68.71,71.45 68.71,73.23 68.46,73.48 59.06,73.48 59.06,67.39 57.54,65.86 57.54,64.59 | 71,68.66 73.28,68.66 C6.2 | 57.54,64.59 59.31,64.59 R11.1 | 57.54,64.59 51.69,64.59 R10.1 51.19,64.59 50.93,64.34 50.93,62.05 | 31.88,37.41 30.61,37.41 30.36,37.16 30.36,36.91 IC5.4 | 31.88,37.41 31.88,36.91 IC5.6 31.88,35.89 31.88,33.6 C8.2 32.14,33.1 35.95,33.1 35.95,15.82 | 31.88,37.41 32.64,38.18 32.64,44.53 IC5.18 32.64,45.54 32.64,47.32 32.9,47.32 33.15,47.57 33.15,62.05 | X6.1 35.95,6.93 35.95,12.27 C2.+ 35.95,14.05 35.95,15.82 | ICSP.2 55.76,49.86 54.74,49.86 54.74,52.65 54.49,52.65 54.49,54.43 53.73,54.43 53.73,56.46 R15.2 52.96,56.72 50.93,56.72 50.93,62.05 | UP.1 9.53,71.2 9.53,75.01 UP.2 | OK.1 21.21,71.2 21.21,75.01 OK.2 | DN.2 32.9,75.01 32.9,71.2 DN.1 33.15,68.66 33.15,62.05 | 33.15,62.05 50.93,62.05
  Bottom 0.305: 21.21,79.58 21.21,77.8 OK.2 | 21.21,79.58 26.8,79.58 30.1,76.28 31.88,76.28 DN.2 | 21.21,79.58 12.58,79.58 11.31,78.31 9.53,78.31 9.53,77.55 UP.2
(copper drawn outside any net)
  shapes: Bottom area x2, Top area x2

### Text on the board
tPlace: THERMISTOR-1 | THERMISTOR-2 | THERMOCOUPLE | store.gnexlab.com | 1 | S | S | D | S | G | MOSFET-2 | S | S | S | D | G | MOSFET-1 | 17 | 9 | 1 | RELAY-2 | RELAY-1 | Reset | Power